# EAGLE design current-sense resistor (EAGLE 9.4.0)
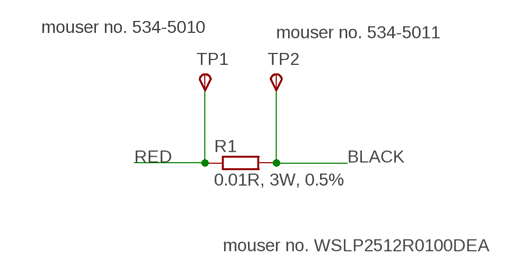
[diagram p0: schematic, sheet 1]

## Parts
R1  0.01R, 3W, 0.5%  R-EU_R2512  [R2512]
TP1  534-5011  TPSPAD1-20  [P1-20]
TP2  534-5010  TPSPAD1-20  [P1-20]

## Nets
BLACK: R1.2 TP2.TP(PP)
RED: R1.1 TP1.TP(PP)

## Notes on the sheet
- mouser no. 534-5010
- mouser no. 534-5011
- mouser no. WSLP2512R0100DEA

## Library data of the parts
R1 = rcl:R-EU_: RESISTOR, European symbol; SPICEPREFIX: R
TP1 TP2 = testpad:TPS: TEST PIN

## Board
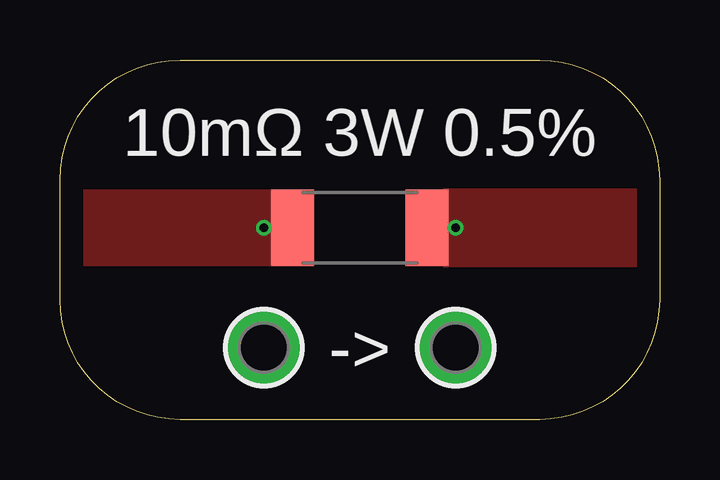
[diagram p1: board, top side]
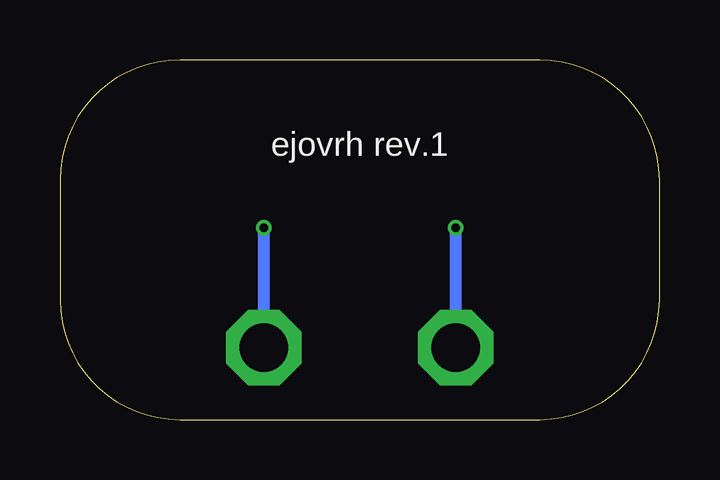
[diagram p2: board, bottom side, seen from below]

Size 25 x 15 mm. Coordinates in mm from the lower left corner, seen from the top.
Outline: 5,15 20,15 arc-90 25,10 25,5 arc-90 20,0 5,0 arc-90 0,5 0,10 arc-90 5,15
Copper layers (1*16): Top 0.035mm / dielectric 1.5mm / Bottom 0.035mm
Design rules "markovac_2layer": minimum track width 0.2mm, minimum drill 0.35mm, track to track 0.2mm, track to pad 0.2mm, pad to pad 0.2mm, via to via 0.2mm, smd to smd 0.2mm, copper to edge 0.5mm, drill to drill 8mil, minimum pad ring 0.15mm, minimum via ring 0.15mm, stop-mask expansion 4mil, vias tented up to drill 0.34mm, thermal gap 10mil

### Footprints (pad centres in the part's own frame; a part is rotated, then mirrored left to right if it is on the bottom)
R2512 = smd 1.8 x 3.2: 1 -2.8,0; 2 2.8,0
P1-20 = drill 2.007 pad 3.15 octagon: TP 0,0

### Placement (x,y rotation side)
R1  12.5,8 0 top
TP1  8.5,3 0 top
TP2  16.5,3 0 top

### Tracks (layer width: path | path; a pad name or v marks a point on that pad's centre or on a via)
BLACK  (via drill 0.35)
  Bottom 0.508: TP2.TP v16.5,8
  pour Top (no thermals): 16,9.6 24,9.6 24,6.4 16,6.4
RED  (via drill 0.35)
  Bottom 0.508: TP1.TP v8.5,8
  pour Top (no thermals): 9,9.6 9,6.4 1,6.4 1,9.6

### Text on the board
tPlace: 10mΩ 3W 0.5% | ->
bPlace: ejovrh rev.1